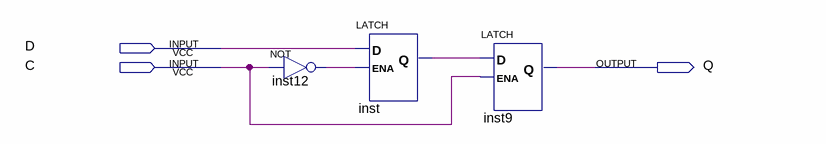
[diagram p0: schematic sheet]
// Quartus schematic latch_.bdf as structural Verilog: 3 symbols, 3 pins
module latch_ (
  input  D,
  input  C,
  output Q
);

  wire inst12_out, inst_q;

  not inst12 (inst12_out, C);
  LATCH inst (.D(D), .ENA(inst12_out), .Q(inst_q));
  LATCH inst9 (.D(inst_q), .ENA(C), .Q(Q));
endmodule
